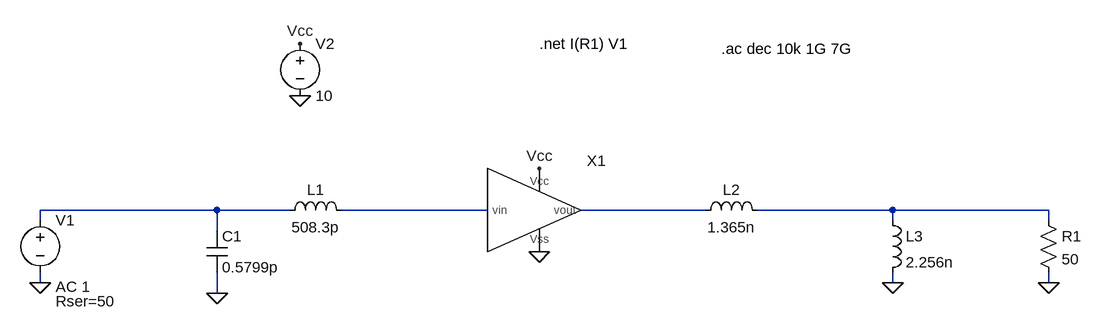
[diagram p0: schematic LC_matching_crispy (Copy).asc]
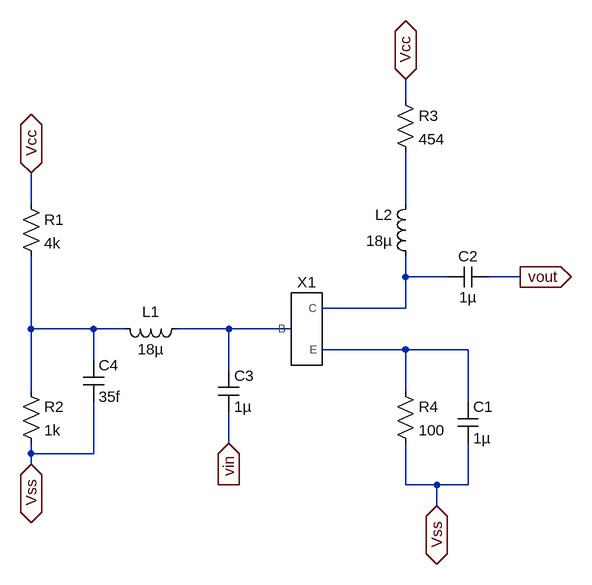
[diagram p1: sub-circuit polarizacao.asc]
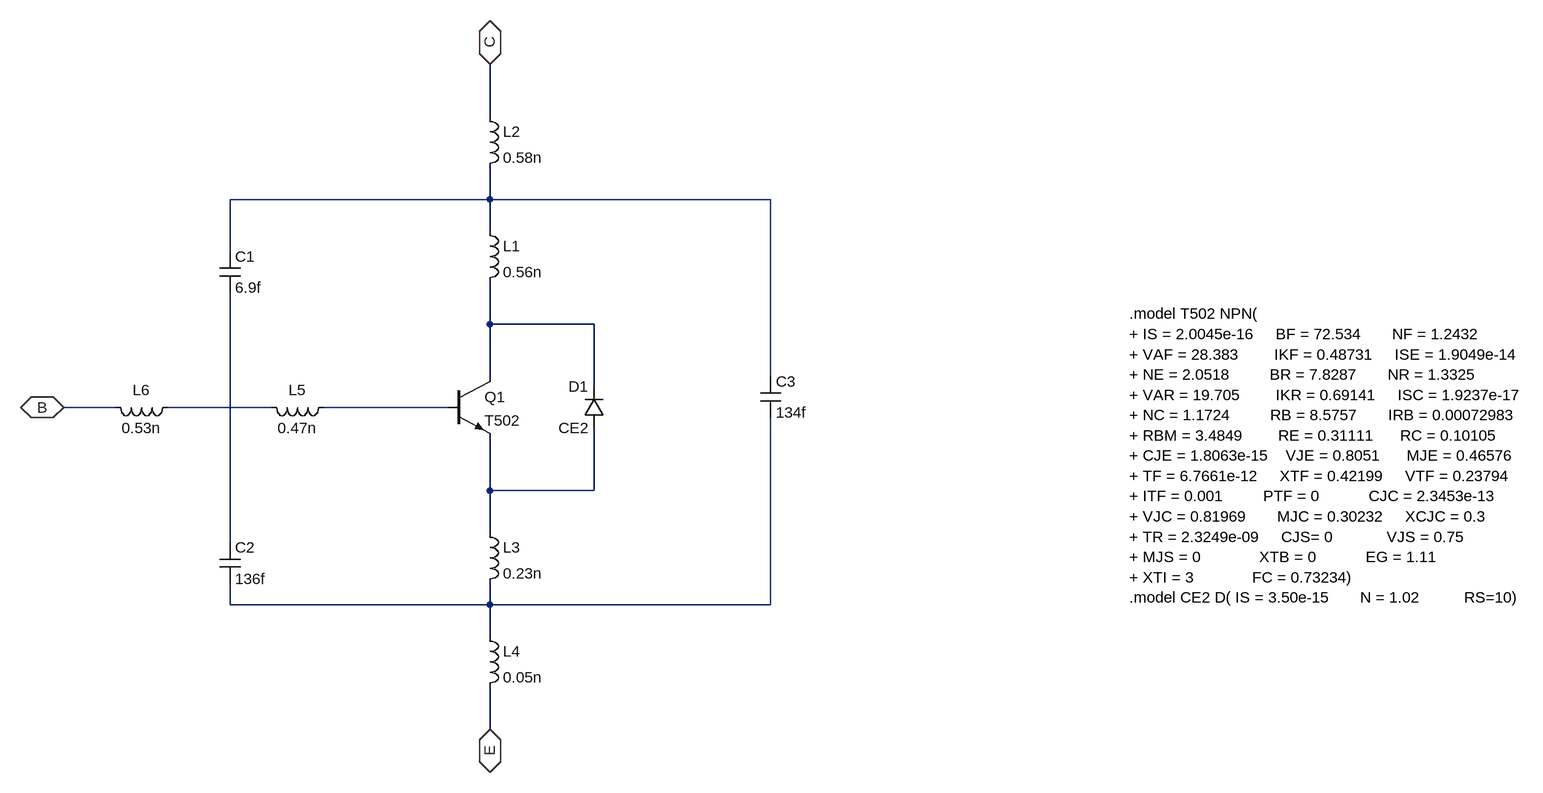
[diagram p2: sub-circuit t_real.asc]
LC_matching_crispy (Copy).asc, the LTspice schematic file:
Version 4.1
SHEET 1 1252 680
WIRE -80 384 -352 384
WIRE 32 384 -80 384
WIRE 336 384 112 384
WIRE 672 384 480 384
WIRE 960 384 752 384
WIRE 1200 384 960 384
WIRE -352 400 -352 384
WIRE 960 400 960 384
WIRE 1200 400 1200 384
WIRE -80 416 -80 384
WIRE -352 496 -352 480
WIRE 960 496 960 480
WIRE 1200 496 1200 480
WIRE -80 512 -80 480
FLAG 48 208 0
FLAG 48 128 Vcc
FLAG 416 320 Vcc
FLAG 416 448 0
FLAG -352 496 0
FLAG 1200 496 0
FLAG -80 512 0
FLAG 960 496 0
SYMBOL Polarizacao 400 384 R0
SYMATTR InstName X1
SYMBOL Voltage -352 384 R0
WINDOW 123 24 118 Left 2
WINDOW 39 24 140 Left 2
SYMATTR Value2 AC 1
SYMATTR SpiceLine Rser=50
SYMATTR InstName V1
SYMATTR Value ""
SYMBOL Res 1184 384 R0
SYMATTR InstName R1
SYMATTR Value 50
SYMBOL Voltage 48 112 R0
SYMATTR InstName V2
SYMATTR Value 10
SYMBOL ind 656 400 R270
WINDOW 0 32 56 VTop 2
WINDOW 3 5 56 VBottom 2
SYMATTR InstName L2
SYMATTR Value 1.365n
SYMBOL ind 944 384 R0
SYMATTR InstName L3
SYMATTR Value 2.256n
SYMBOL cap -96 416 R0
SYMATTR InstName C1
SYMATTR Value 0.5799p
SYMBOL ind 16 400 R270
WINDOW 0 32 56 VTop 2
WINDOW 3 5 56 VBottom 2
SYMATTR InstName L1
SYMATTR Value 508.3p
TEXT 416 128 Left 2 !.net I(R1) V1
TEXT 696 136 Left 2 !.ac dec 10k 1G 7G

polarizacao.asc, the sub-circuit schematic file:
Version 4
SHEET 1 880 992
WIRE 464 0 464 -32
WIRE -112 160 -112 112
WIRE 464 160 464 80
WIRE 464 272 464 240
WIRE 528 272 464 272
WIRE 640 272 592 272
WIRE 464 320 464 272
WIRE 464 320 336 320
WIRE -112 352 -112 240
WIRE -16 352 -112 352
WIRE 32 352 -16 352
WIRE 192 352 112 352
WIRE 288 352 192 352
WIRE 464 384 336 384
WIRE 560 384 464 384
WIRE -16 400 -16 352
WIRE 192 416 192 352
WIRE -112 448 -112 352
WIRE 464 448 464 384
WIRE 560 464 560 384
WIRE 192 528 192 480
WIRE -112 544 -112 528
WIRE -16 544 -16 464
WIRE -16 544 -112 544
WIRE -112 560 -112 544
WIRE 464 592 464 528
WIRE 512 592 464 592
WIRE 560 592 560 528
WIRE 560 592 512 592
WIRE 512 624 512 592
FLAG -112 112 Vcc
IOPIN -112 112 BiDir
FLAG 464 -32 Vcc
IOPIN 464 -32 BiDir
FLAG 192 528 vin
IOPIN 192 528 In
FLAG 640 272 vout
IOPIN 640 272 Out
FLAG -112 560 Vss
IOPIN -112 560 BiDir
FLAG 512 624 Vss
IOPIN 512 624 BiDir
SYMBOL T_real 304 352 R0
SYMATTR InstName X1
SYMBOL ind 128 336 R90
WINDOW 0 5 56 VBottom 2
WINDOW 3 32 56 VTop 2
SYMATTR InstName L1
SYMATTR Value 18µ
SYMBOL ind 480 256 R180
WINDOW 0 36 80 Left 2
WINDOW 3 36 40 Left 2
SYMATTR InstName L2
SYMATTR Value 18µ
SYMBOL Res -128 144 R0
SYMATTR InstName R1
SYMATTR Value 4k
SYMBOL Res -128 432 R0
SYMATTR InstName R2
SYMATTR Value 1k
SYMBOL Res 448 -16 R0
SYMATTR InstName R3
SYMATTR Value 454
SYMBOL Res 448 432 R0
SYMATTR InstName R4
SYMATTR Value 100
SYMBOL Cap 544 464 R0
SYMATTR InstName C1
SYMATTR Value 1µ
SYMBOL Cap 592 256 R90
WINDOW 0 0 32 VBottom 2
WINDOW 3 32 32 VTop 2
SYMATTR InstName C2
SYMATTR Value 1µ
SYMBOL Cap 176 416 R0
SYMATTR InstName C3
SYMATTR Value 1µ
SYMBOL Cap -32 400 R0
SYMATTR InstName C4
SYMATTR Value 35f

t_real.asc, the sub-circuit schematic file:
Version 4
SHEET 1 2024 876
WIRE 416 -128 416 -208
WIRE 416 0 416 -48
WIRE 416 0 16 0
WIRE 848 0 416 0
WIRE 416 48 416 0
WIRE 16 80 16 0
WIRE 416 192 416 128
WIRE 576 192 416 192
WIRE 416 272 416 192
WIRE 848 272 848 0
WIRE 576 288 576 192
WIRE -160 320 -240 320
WIRE 80 320 -80 320
WIRE 352 320 160 320
WIRE 416 448 416 368
WIRE 576 448 576 352
WIRE 576 448 416 448
WIRE 416 512 416 448
WIRE 16 528 16 144
WIRE 16 624 16 592
WIRE 416 624 416 592
WIRE 416 624 16 624
WIRE 848 624 848 336
WIRE 848 624 416 624
WIRE 416 672 416 624
WIRE 416 816 416 752
FLAG -240 320 B
IOPIN -240 320 BiDir
FLAG 416 -208 C
IOPIN 416 -208 BiDir
FLAG 416 816 E
IOPIN 416 816 BiDir
SYMBOL npn 352 272 R0
SYMATTR InstName Q1
SYMATTR Value T502
SYMBOL Diode 592 352 R180
WINDOW 0 24 64 Left 2
WINDOW 3 24 0 Left 2
SYMATTR InstName D1
SYMATTR Value CE2
SYMBOL ind 400 32 R0
SYMATTR InstName L1
SYMATTR Value 0.56n
SYMBOL ind 400 -144 R0
SYMATTR InstName L2
SYMATTR Value 0.58n
SYMBOL ind 400 496 R0
SYMATTR InstName L3
SYMATTR Value 0.23n
SYMBOL ind 400 656 R0
SYMATTR InstName L4
SYMATTR Value 0.05n
SYMBOL ind 176 304 R90
WINDOW 0 5 56 VBottom 2
WINDOW 3 32 56 VTop 2
SYMATTR InstName L5
SYMATTR Value 0.47n
SYMBOL ind -64 304 R90
WINDOW 0 5 56 VBottom 2
WINDOW 3 32 56 VTop 2
SYMATTR InstName L6
SYMATTR Value 0.53n
SYMBOL Cap 0 80 R0
SYMATTR InstName C1
SYMATTR Value 6.9f
SYMBOL Cap 0 528 R0
SYMATTR InstName C2
SYMATTR Value 136f
SYMBOL Cap 832 272 R0
SYMATTR InstName C3
SYMATTR Value 134f
TEXT 1400 176 Left 2 !.model T502 NPN(\n+ IS = 2.0045e-16     BF = 72.534       NF = 1.2432\n+ VAF = 28.383        IKF = 0.48731     ISE = 1.9049e-14\n+ NE = 2.0518         BR = 7.8287       NR = 1.3325\n+ VAR = 19.705        IKR = 0.69141     ISC = 1.9237e-17\n+ NC = 1.1724         RB = 8.5757       IRB = 0.00072983\n+ RBM = 3.4849        RE = 0.31111      RC = 0.10105\n+ CJE = 1.8063e-15    VJE = 0.8051      MJE = 0.46576\n+ TF = 6.7661e-12     XTF = 0.42199     VTF = 0.23794\n+ ITF = 0.001         PTF = 0           CJC = 2.3453e-13\n+ VJC = 0.81969       MJC = 0.30232     XCJC = 0.3\n+ TR = 2.3249e-09     CJS= 0            VJS = 0.75\n+ MJS = 0             XTB = 0           EG = 1.11\n+ XTI = 3             FC = 0.73234)\n.model CE2 D( IS = 3.50e-15       N = 1.02          RS=10)

The netlist it stands for:
* LC_matching_crispy (Copy).asc
X§X1 N002 Vcc N003 0 polarizacao
V1 N001 0 AC 1 Rser=50
R1 N004 0 50
V2 Vcc 0 10
L2 N003 N004 1.365n
L3 N004 0 2.256n
C1 N001 0 0.5799p
L1 N001 N002 508.3p

* block symbol definitions
.subckt polarizacao vin Vcc vout Vss
XX1 N004 N002 N005 t_real
L1 N004 N003 18µ
L2 N002 N001 18µ
R1 Vcc N003 4k
R2 N003 Vss 1k
R3 Vcc N001 454
R4 N005 Vss 100
C1 N005 Vss 1µ
C2 vout N002 1µ
C3 N004 vin 1µ
C4 N003 Vss 35f
.ends polarizacao

.subckt t_real B C E
Q1 N002 N004 N005 0 T502
D1 N005 N002 CE2
L1 N001 N002 0.56n
L2 C N001 0.58n
L3 N005 N007 0.23n
L4 N007 E 0.05n
L5 N004 N003 0.47n
L6 N003 B 0.53n
C1 N001 N006 6.9f
C2 N006 N007 136f
C3 N001 N007 134f
.model T502 NPN(
+ IS = 2.0045e-16     BF = 72.534       NF = 1.2432
+ VAF = 28.383        IKF = 0.48731     ISE = 1.9049e-14
+ NE = 2.0518         BR = 7.8287       NR = 1.3325
+ VAR = 19.705        IKR = 0.69141     ISC = 1.9237e-17
+ NC = 1.1724         RB = 8.5757       IRB = 0.00072983
+ RBM = 3.4849        RE = 0.31111      RC = 0.10105
+ CJE = 1.8063e-15    VJE = 0.8051      MJE = 0.46576
+ TF = 6.7661e-12     XTF = 0.42199     VTF = 0.23794
+ ITF = 0.001         PTF = 0           CJC = 2.3453e-13
+ VJC = 0.81969       MJC = 0.30232     XCJC = 0.3
+ TR = 2.3249e-09     CJS= 0            VJS = 0.75
+ MJS = 0             XTB = 0           EG = 1.11
+ XTI = 3             FC = 0.73234)
.model CE2 D( IS = 3.50e-15       N = 1.02          RS=10)
.ends t_real

.model D D
.lib standard.dio
.model NPN NPN
.model PNP PNP
.lib standard.bjt
.net I(R1) V1
.ac dec 10k 1G 7G
.backanno
.end